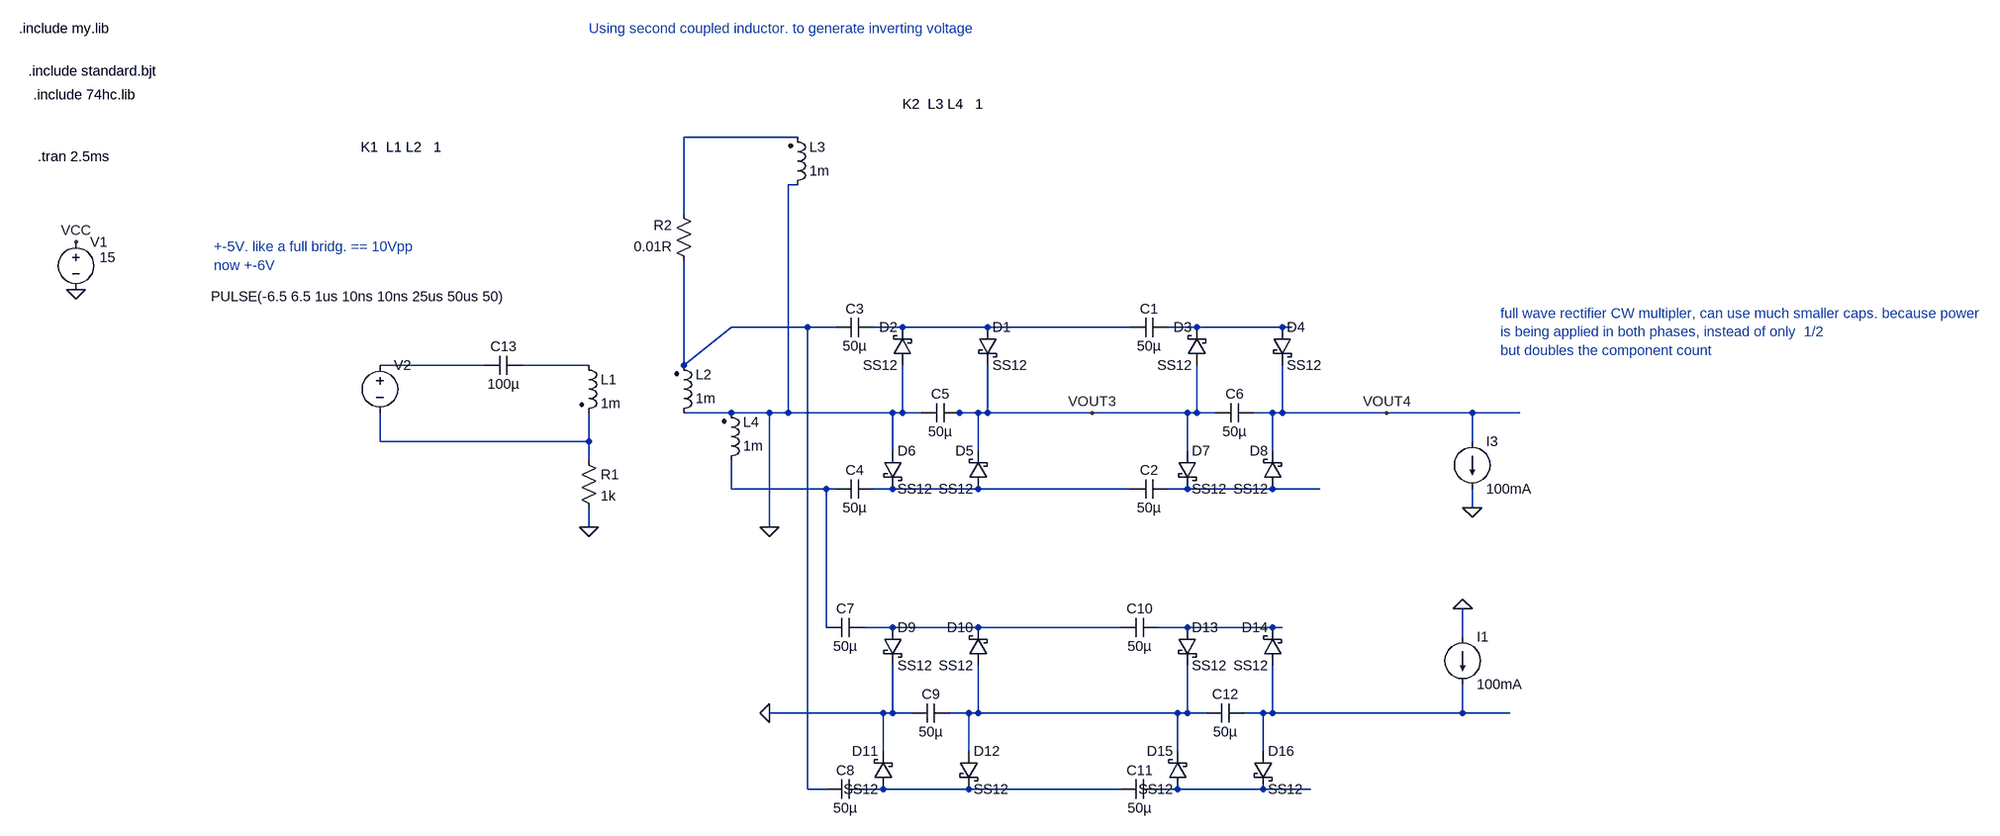
[diagram p0: schematic Draft28.asc]
Draft28.asc, the LTspice schematic file:
Version 4
SHEET 1 5720 1740
WIRE 1856 -512 1664 -512
WIRE 1856 -432 1840 -432
WIRE 1664 -384 1664 -512
WIRE 1872 -192 1744 -192
WIRE 1920 -192 1872 -192
WIRE 2032 -192 1984 -192
WIRE 2176 -192 2032 -192
WIRE 2416 -192 2176 -192
WIRE 2528 -192 2480 -192
WIRE 2672 -192 2528 -192
WIRE 2688 -192 2672 -192
WIRE 1328 -128 1152 -128
WIRE 1504 -128 1392 -128
WIRE 1664 -128 1664 -304
WIRE 1664 -128 1744 -192
WIRE 1744 -48 1664 -48
WIRE 1808 -48 1744 -48
WIRE 1840 -48 1840 -432
WIRE 1840 -48 1808 -48
WIRE 2016 -48 1840 -48
WIRE 2032 -48 2032 -128
WIRE 2032 -48 2016 -48
WIRE 2064 -48 2032 -48
WIRE 2128 -48 2112 -48
WIRE 2160 -48 2128 -48
WIRE 2176 -48 2176 -128
WIRE 2176 -48 2160 -48
WIRE 2352 -48 2176 -48
WIRE 2512 -48 2352 -48
WIRE 2528 -48 2528 -128
WIRE 2528 -48 2512 -48
WIRE 2560 -48 2528 -48
WIRE 2656 -48 2624 -48
WIRE 2672 -48 2672 -128
WIRE 2672 -48 2656 -48
WIRE 2848 -48 2672 -48
WIRE 2992 -48 2848 -48
WIRE 3072 -48 2992 -48
WIRE 1152 0 1152 -48
WIRE 1504 0 1504 -48
WIRE 1504 0 1152 0
WIRE 2992 0 2992 -48
WIRE 2016 16 2016 -48
WIRE 2160 16 2160 -48
WIRE 2512 16 2512 -48
WIRE 2656 16 2656 -48
WIRE 1504 32 1504 0
WIRE 1744 80 1744 32
WIRE 1904 80 1744 80
WIRE 1920 80 1904 80
WIRE 2016 80 1984 80
WIRE 2160 80 2016 80
WIRE 2416 80 2160 80
WIRE 2512 80 2480 80
WIRE 2656 80 2512 80
WIRE 2736 80 2656 80
WIRE 2992 112 2992 80
WIRE 1504 144 1504 112
WIRE 1808 144 1808 -48
WIRE 1904 352 1904 80
WIRE 2016 352 1968 352
WIRE 2160 352 2016 352
WIRE 2400 352 2160 352
WIRE 2512 352 2464 352
WIRE 2656 352 2512 352
WIRE 2672 352 2656 352
WIRE 2976 368 2976 320
WIRE 2000 496 1808 496
WIRE 2016 496 2016 416
WIRE 2016 496 2000 496
WIRE 2048 496 2016 496
WIRE 2144 496 2112 496
WIRE 2160 496 2160 416
WIRE 2160 496 2144 496
WIRE 2496 496 2160 496
WIRE 2512 496 2512 416
WIRE 2512 496 2496 496
WIRE 2544 496 2512 496
WIRE 2640 496 2608 496
WIRE 2656 496 2656 416
WIRE 2656 496 2640 496
WIRE 2976 496 2976 448
WIRE 2976 496 2656 496
WIRE 3056 496 2976 496
WIRE 2000 560 2000 496
WIRE 2144 560 2144 496
WIRE 2496 560 2496 496
WIRE 2640 560 2640 496
WIRE 1872 624 1872 -192
WIRE 1904 624 1872 624
WIRE 2000 624 1968 624
WIRE 2144 624 2000 624
WIRE 2400 624 2144 624
WIRE 2496 624 2464 624
WIRE 2640 624 2496 624
WIRE 2720 624 2640 624
FLAG 1808 144 0
FLAG 640 -256 0
FLAG 640 -336 VCC
FLAG 1504 144 0
FLAG 2352 -48 VOUT3
FLAG 2992 112 0
FLAG 2848 -48 VOUT4
FLAG 2976 320 0
FLAG 1808 496 0
SYMBOL ind2 1840 -416 M180
WINDOW 0 36 80 Left 2
WINDOW 3 36 40 Left 2
SYMATTR InstName L3
SYMATTR Value 1m
SYMATTR Type ind
SYMBOL ind2 1728 48 M180
WINDOW 0 36 80 Left 2
WINDOW 3 36 40 Left 2
SYMATTR InstName L4
SYMATTR Value 1m
SYMATTR Type ind
SYMBOL voltage 640 -352 R0
WINDOW 123 0 0 Left 0
WINDOW 39 0 0 Left 0
WINDOW 3 40 42 Left 2
SYMATTR Value 15
SYMATTR InstName V1
SYMBOL ind2 1488 -144 R0
SYMATTR InstName L1
SYMATTR Value 1m
SYMATTR Type ind
SYMBOL voltage 1152 -144 R0
WINDOW 123 0 0 Left 0
WINDOW 39 0 0 Left 0
WINDOW 3 -285 -100 Left 2
SYMATTR Value PULSE(-6.5 6.5 1us 10ns 10ns 25us 50us 50)
SYMATTR InstName V2
SYMBOL cap 1984 -208 R90
WINDOW 0 0 32 VBottom 2
WINDOW 3 32 32 VTop 2
SYMATTR InstName C3
SYMATTR Value 50µ
SYMBOL cap 1984 64 R90
WINDOW 0 0 32 VBottom 2
WINDOW 3 32 32 VTop 2
SYMATTR InstName C4
SYMATTR Value 50µ
SYMBOL cap 2064 -32 R270
WINDOW 0 32 32 VTop 2
WINDOW 3 0 32 VBottom 2
SYMATTR InstName C5
SYMATTR Value 50µ
SYMBOL current 2992 0 R0
WINDOW 123 0 0 Left 0
WINDOW 39 0 0 Left 0
SYMATTR InstName I3
SYMATTR Value 100mA
SYMBOL ind2 1648 -32 M180
WINDOW 0 36 80 Left 2
WINDOW 3 36 40 Left 2
SYMATTR InstName L2
SYMATTR Value 1m
SYMATTR Type ind
SYMBOL res 1680 -288 R180
WINDOW 0 36 76 Left 2
WINDOW 3 36 40 Left 2
SYMATTR InstName R2
SYMATTR Value 0.01R
SYMBOL cap 2480 -208 R90
WINDOW 0 0 32 VBottom 2
WINDOW 3 32 32 VTop 2
SYMATTR InstName C1
SYMATTR Value 50µ
SYMBOL cap 2480 64 R90
WINDOW 0 0 32 VBottom 2
WINDOW 3 32 32 VTop 2
SYMATTR InstName C2
SYMATTR Value 50µ
SYMBOL cap 2560 -32 R270
WINDOW 0 32 32 VTop 2
WINDOW 3 0 32 VBottom 2
SYMATTR InstName C6
SYMATTR Value 50µ
SYMBOL cap 1968 336 R90
WINDOW 0 0 32 VBottom 2
WINDOW 3 32 32 VTop 2
SYMATTR InstName C7
SYMATTR Value 50µ
SYMBOL cap 1968 608 R90
WINDOW 0 0 32 VBottom 2
WINDOW 3 32 32 VTop 2
SYMATTR InstName C8
SYMATTR Value 50µ
SYMBOL cap 2048 512 R270
WINDOW 0 32 32 VTop 2
WINDOW 3 0 32 VBottom 2
SYMATTR InstName C9
SYMATTR Value 50µ
SYMBOL cap 2464 336 R90
WINDOW 0 0 32 VBottom 2
WINDOW 3 32 32 VTop 2
SYMATTR InstName C10
SYMATTR Value 50µ
SYMBOL cap 2464 608 R90
WINDOW 0 0 32 VBottom 2
WINDOW 3 32 32 VTop 2
SYMATTR InstName C11
SYMATTR Value 50µ
SYMBOL cap 2544 512 R270
WINDOW 0 32 32 VTop 2
WINDOW 3 0 32 VBottom 2
SYMATTR InstName C12
SYMATTR Value 50µ
SYMBOL current 2976 368 R0
WINDOW 123 0 0 Left 0
WINDOW 39 0 0 Left 0
SYMATTR InstName I1
SYMATTR Value 100mA
SYMBOL schottky 2048 -128 R180
WINDOW 0 24 64 Left 2
WINDOW 3 24 0 Left 2
SYMATTR InstName D2
SYMATTR Value SS12
SYMATTR Description Diode
SYMATTR Type diode
SYMBOL schottky 2176 80 R180
WINDOW 0 24 64 Left 2
WINDOW 3 24 0 Left 2
SYMATTR InstName D5
SYMATTR Value SS12
SYMATTR Description Diode
SYMATTR Type diode
SYMBOL schottky 2176 416 R180
WINDOW 0 24 64 Left 2
WINDOW 3 24 0 Left 2
SYMATTR InstName D10
SYMATTR Value SS12
SYMATTR Description Diode
SYMATTR Type diode
SYMBOL schottky 2016 624 R180
WINDOW 0 24 64 Left 2
WINDOW 3 24 0 Left 2
SYMATTR InstName D11
SYMATTR Value SS12
SYMATTR Description Diode
SYMATTR Type diode
SYMBOL schottky 2160 -192 R0
SYMATTR InstName D1
SYMATTR Value SS12
SYMATTR Description Diode
SYMATTR Type diode
SYMBOL schottky 2000 16 R0
SYMATTR InstName D6
SYMATTR Value SS12
SYMATTR Description Diode
SYMATTR Type diode
SYMBOL schottky 2000 352 R0
SYMATTR InstName D9
SYMATTR Value SS12
SYMATTR Description Diode
SYMATTR Type diode
SYMBOL schottky 2128 560 R0
SYMATTR InstName D12
SYMATTR Value SS12
SYMATTR Description Diode
SYMATTR Type diode
SYMBOL schottky 2544 -128 R180
WINDOW 0 24 64 Left 2
WINDOW 3 24 0 Left 2
SYMATTR InstName D3
SYMATTR Value SS12
SYMATTR Description Diode
SYMATTR Type diode
SYMBOL schottky 2672 80 R180
WINDOW 0 24 64 Left 2
WINDOW 3 24 0 Left 2
SYMATTR InstName D8
SYMATTR Value SS12
SYMATTR Description Diode
SYMATTR Type diode
SYMBOL schottky 2672 416 R180
WINDOW 0 24 64 Left 2
WINDOW 3 24 0 Left 2
SYMATTR InstName D14
SYMATTR Value SS12
SYMATTR Description Diode
SYMATTR Type diode
SYMBOL schottky 2512 624 R180
WINDOW 0 24 64 Left 2
WINDOW 3 24 0 Left 2
SYMATTR InstName D15
SYMATTR Value SS12
SYMATTR Description Diode
SYMATTR Type diode
SYMBOL schottky 2656 -192 R0
SYMATTR InstName D4
SYMATTR Value SS12
SYMATTR Description Diode
SYMATTR Type diode
SYMBOL schottky 2496 16 R0
SYMATTR InstName D7
SYMATTR Value SS12
SYMATTR Description Diode
SYMATTR Type diode
SYMBOL schottky 2496 352 R0
SYMATTR InstName D13
SYMATTR Value SS12
SYMATTR Description Diode
SYMATTR Type diode
SYMBOL schottky 2624 560 R0
SYMATTR InstName D16
SYMATTR Value SS12
SYMATTR Description Diode
SYMATTR Type diode
SYMBOL cap 1392 -144 R90
WINDOW 0 0 32 VBottom 2
WINDOW 3 32 32 VTop 2
SYMATTR InstName C13
SYMATTR Value 100µ
SYMBOL res 1488 16 R0
SYMATTR InstName R1
SYMATTR Value 1k
TEXT 576 -480 Left 2 !.tran 2.5ms
TEXT 1120 -496 Left 2 !K1  L1 L2   1
TEXT 560 -624 Left 2 !.include standard.bjt
TEXT 544 -696 Left 2 !.include my.lib
TEXT 568 -584 Left 2 !.include 74hc.lib
TEXT 872 -328 Left 2 ;+-5V. like a full bridg. == 10Vpp\nnow +-6V
TEXT 3040 -216 Left 2 ;full wave rectifier CW multipler, can use much smaller caps. because power\nis being applied in both phases, instead of only  1/2\nbut doubles the component count
TEXT 2032 -568 Left 2 !K2  L3 L4   1
TEXT 1504 -696 Left 2 ;Using second coupled inductor. to generate inverting voltage

The netlist it stands for:
* Draft28.asc
L3 0 N001 1m
L4 N008 0 1m
V1 VCC 0 15
L1 N006 N007 1m
V2 N005 N007 PULSE(-6.5 6.5 1us 10ns 10ns 25us 50us 50)
C3 N003 N002 50µ
C4 N009 N008 50µ
C5 0 VOUT3 50µ
I3 VOUT4 0 100mA
L2 0 N002 1m
R2 N002 N001 0.01R
C1 N004 N003 50µ
C2 N010 N009 50µ
C6 VOUT3 VOUT4 50µ
C7 N011 N008 50µ
C8 N015 N002 50µ
C9 0 N013 50µ
C10 N012 N011 50µ
C11 N016 N015 50µ
C12 N013 N014 50µ
I1 0 N014 100mA
D2 0 N003 SS12
D5 N009 VOUT3 SS12
D10 N013 N011 SS12
D11 N015 0 SS12
D1 N003 VOUT3 SS12
D6 0 N009 SS12
D9 N011 0 SS12
D12 N013 N015 SS12
D3 VOUT3 N004 SS12
D8 N010 VOUT4 SS12
D14 N014 N012 SS12
D15 N016 N013 SS12
D4 N004 VOUT4 SS12
D7 VOUT3 N010 SS12
D13 N012 N013 SS12
D16 N014 N016 SS12
C13 N006 N005 100µ
R1 N007 0 1k
.model D D
.lib standard.dio
.tran 2.5ms
K1  L1 L2   1
.include standard.bjt
.include my.lib
.include 74hc.lib
* +-5V. like a full bridg. == 10Vpp
* now +-6V
* full wave rectifier CW multipler, can use much smaller caps. because power
* is being applied in both phases, instead of only  1/2
* but doubles the component count
K2  L3 L4   1
* Using second coupled inductor. to generate inverting voltage
.backanno
.end